# EAGLE schematic sh7_redraw (EAGLE 8.5.1)
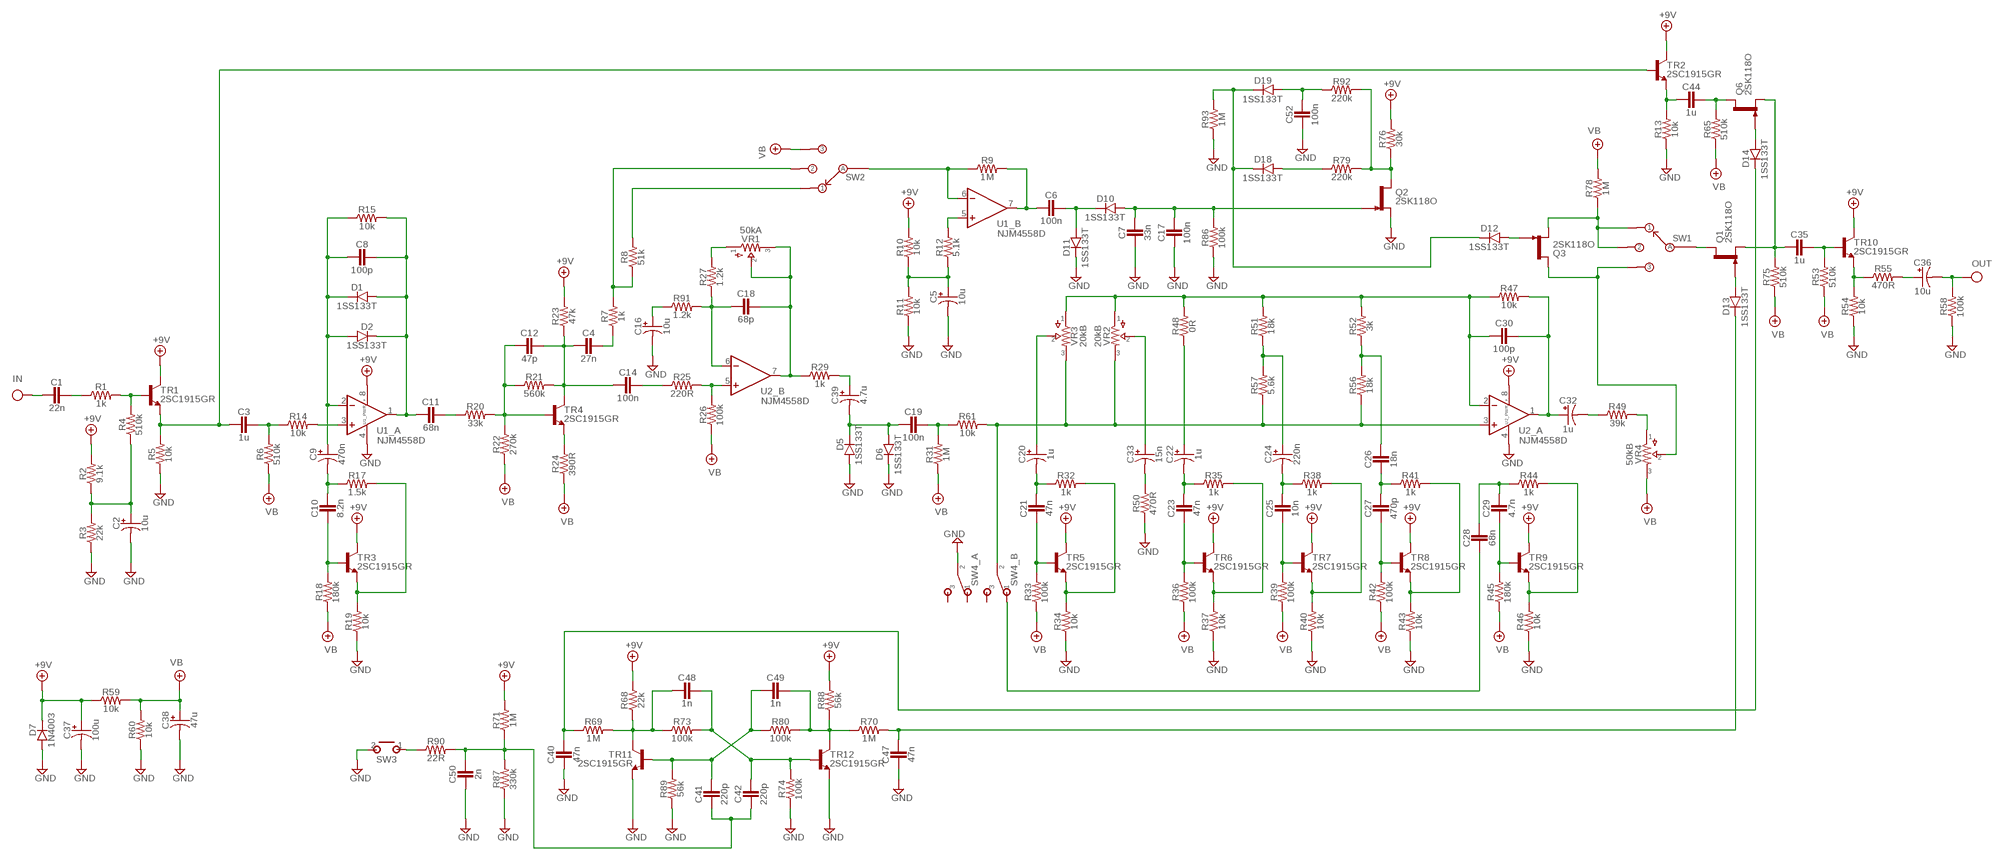
[diagram p0: schematic, sheet 1]

## Parts
C1  22n  CER/FILMBOX.1  [BOX_SMALL]
C2  10u  0400  [040_020]
C3  1u  CER/FILMBOX.1  [BOX_SMALL]
C4  27n  CER/FILMBOX.1  [BOX_SMALL]
C5  10u  0400  [040_020]
C6  100n  CER/FILMBOX.1  [BOX_SMALL]
C7  33n  CER/FILMBOX.1  [BOX_SMALL]
C8  100p  CER/FILMBOX.1  [BOX_SMALL]
C9  470n  0400  [040_020]
C10  8.2n  CER/FILMBOX.1  [BOX_SMALL]
C11  68n  CER/FILMBOX.1  [BOX_SMALL]
C12  47p  CER/FILMBOX.1  [BOX_SMALL]
C14  100n  CER/FILMBOX.1  [BOX_SMALL]
C16  10u  0400  [040_020]
C17  100n  CER/FILMBOX.1  [BOX_SMALL]
C18  68p  CER/FILMBOX.1  [BOX_SMALL]
C19  100n  CER/FILMBOX.1  [BOX_SMALL]
C20  1u  0400  [040_020]
C21  47n  CER/FILMBOX.1  [BOX_SMALL]
C22  1u  0400  [040_020]
C23  47n  CER/FILMBOX.1  [BOX_SMALL]
C24  220n  0400  [040_020]
C25  10n  CER/FILMBOX.1  [BOX_SMALL]
C26  18n  CER/FILMBOX.1  [BOX_SMALL]
C27  470p  CER/FILMBOX.1  [BOX_SMALL]
C28  68n  CER/FILMBOX.1  [BOX_SMALL]
C29  4.7n  CER/FILMBOX.1  [BOX_SMALL]
C30  100p  CER/FILMBOX.1  [BOX_SMALL]
C32  1u  0400  [040_020]
C33  15n  0400  [040_020]
C35  1u  CER/FILMBOX.1  [BOX_SMALL]
C36  10u  0400  [040_020]
C37  100u  0400  [040_020]
C38  47u  0400  [040_020]
C39  4.7u  0400  [040_020]
C40  47n  CER/FILMBOX.1  [BOX_SMALL]
C41  220p  CER/FILMBOX.1  [BOX_SMALL]
C42  220p  CER/FILMBOX.1  [BOX_SMALL]
C44  1u  CER/FILMBOX.1  [BOX_SMALL]
C47  47n  CER/FILMBOX.1  [BOX_SMALL]
C48  1n  CER/FILMBOX.1  [BOX_SMALL]
C49  1n  CER/FILMBOX.1  [BOX_SMALL]
C50  2n  CER/FILMBOX.1  [BOX_SMALL]
C52  100n  CER/FILMBOX.1  [BOX_SMALL]
D1  1SS133T  DO41.2  [DO41-2]
D2  1SS133T  DO41.2  [DO41-2]
D5  1SS133T  DO41.2  [DO41-2]
D6  1SS133T  DO41.2  [DO41-2]
D7  1N4003  DO41.2  [DO41-2]
D10  1SS133T  DO41.2  [DO41-2]
D11  1SS133T  DO41.2  [DO41-2]
D12  1SS133T  DO41.2  [DO41-2]
D13  1SS133T  DO41.2  [DO41-2]
D14  1SS133T  DO41.2  [DO41-2]
D18  1SS133T  DO41.2  [DO41-2]
D19  1SS133T  DO41.2  [DO41-2]
Q1  2SK118O  2N5457  [TO92-]
Q2  2SK118O  2N5457  [TO92-]
Q3  2SK118O  2N5457  [TO92-]
Q6  2SK118O  2N5457  [TO92-]
R1  1k  R_.3B  [R0207/3]
R2  9.1k  R_.3B  [R0207/3]
R3  22k  R_.3B  [R0207/3]
R4  510k  R_.3B  [R0207/3]
R5  10k  R_.3B  [R0207/3]
R6  510k  R_.3B  [R0207/3]
R7  1k  R_.3B  [R0207/3]
R8  51k  R_.3B  [R0207/3]
R9  1M  R_.3B  [R0207/3]
R10  10k  R_.3B  [R0207/3]
R11  10k  R_.3B  [R0207/3]
R12  5.1k  R_.3B  [R0207/3]
R13  10k  R_.3B  [R0207/3]
R14  10k  R_.3B  [R0207/3]
R15  10k  R_.3B  [R0207/3]
R17  1.5k  R_.3B  [R0207/3]
R18  180k  R_.3B  [R0207/3]
R19  10k  R_.3B  [R0207/3]
R20  33k  R_.3B  [R0207/3]
R21  560k  R_.3B  [R0207/3]
R22  270k  R_.3B  [R0207/3]
R23  47k  R_.3B  [R0207/3]
R24  390R  R_.3B  [R0207/3]
R25  220R  R_.3B  [R0207/3]
R26  100k  R_.3B  [R0207/3]
R27  1.2k  R_.3B  [R0207/3]
R29  1k  R_.3B  [R0207/3]
R31  1M  R_.3B  [R0207/3]
R32  1k  R_.3B  [R0207/3]
R33  100k  R_.3B  [R0207/3]
R34  10k  R_.3B  [R0207/3]
R35  1k  R_.3B  [R0207/3]
R36  100k  R_.3B  [R0207/3]
R37  10k  R_.3B  [R0207/3]
R38  1k  R_.3B  [R0207/3]
R39  100k  R_.3B  [R0207/3]
R40  10k  R_.3B  [R0207/3]
R41  1k  R_.3B  [R0207/3]
R42  100k  R_.3B  [R0207/3]
R43  10k  R_.3B  [R0207/3]
R44  1k  R_.3B  [R0207/3]
R45  180k  R_.3B  [R0207/3]
R46  10k  R_.3B  [R0207/3]
R47  10k  R_.3B  [R0207/3]
R48  0R  R_.3B  [R0207/3]
R49  39k  R_.3B  [R0207/3]
R50  470R  R_.3B  [R0207/3]
R51  18k  R_.3B  [R0207/3]
R52  3k  R_.3B  [R0207/3]
R53  510k  R_.3B  [R0207/3]
R54  10k  R_.3B  [R0207/3]
R55  470R  R_.3B  [R0207/3]
R56  18k  R_.3B  [R0207/3]
R57  5.6k  R_.3B  [R0207/3]
R58  100k  R_.3B  [R0207/3]
R59  10k  R_.3B  [R0207/3]
R60  10k  R_.3B  [R0207/3]
R61  10k  R_.3B  [R0207/3]
R65  510k  R_.3B  [R0207/3]
R68  22k  R_.3B  [R0207/3]
R69  1M  R_.3B  [R0207/3]
R70  1M  R_.3B  [R0207/3]
R71  1M  R_.3B  [R0207/3]
R73  100k  R_.3B  [R0207/3]
R74  100k  R_.3B  [R0207/3]
R75  510k  R_.3B  [R0207/3]
R76  30k  R_.3B  [R0207/3]
R78  1M  R_.3B  [R0207/3]
R79  220k  R_.3B  [R0207/3]
R80  100k  R_.3B  [R0207/3]
R86  100k  R_.3B  [R0207/3]
R87  330k  R_.3B  [R0207/3]
R88  56k  R_.3B  [R0207/3]
R89  56k  R_.3B  [R0207/3]
R90  22R  R_.3B  [R0207/3]
R91  1.2k  R_.3B  [R0207/3]
R92  220k  R_.3B  [R0207/3]
R93  1M  R_.3B  [R0207/3]
SW1  1P3T  [1P3T]
SW2  1P3T  [1P3T]
SW3  MOMENTARY  [SPST]
SW4  DPDT  [DPDT]
TR1  2SC1915GR  2SC828A  [TO92-]
TR2  2SC1915GR  2SC828A  [TO92-]
TR3  2SC1915GR  2SC828A  [TO92-]
TR4  2SC1915GR  2SC828A  [TO92-]
TR5  2SC1915GR  2SC828A  [TO92-]
TR6  2SC1915GR  2SC828A  [TO92-]
TR7  2SC1915GR  2SC828A  [TO92-]
TR8  2SC1915GR  2SC828A  [TO92-]
TR9  2SC1915GR  2SC828A  [TO92-]
TR10  2SC1915GR  2SC828A  [TO92-]
TR11  2SC1915GR  2SC828A  [TO92-]
TR12  2SC1915GR  2SC828A  [TO92-]
U1  NJM4558D  DUALTH  [DIL0]
U2  NJM4558D  DUALTH  [DIL0]
VR1  50kA  POTS16MM  [16MM]
VR2  20kB  POTS16MM  [16MM]
VR3  20kB  POTS16MM  [16MM]
VR4  50kB  POTS16MM  [16MM]

## Nets
+9V: C37.+ D7.C R2.2 R10.2 R23.2 R59.1 R68.2 R71.2 R76.2 R88.2 TR1.2(C) TR2.2(C) TR3.2(C) TR5.2(C) TR6.2(C) TR7.2(C) TR8.2(C) TR9.2(C) TR10.2(C) U1.8(_PWR:V+) U2.8(_PWR:V+)
GND: C2.- C5.- C7.2 C16.- C17.2 C37.- C38.- C40.2 C47.2 C50.2 C52.2 D5.A D6.C D7.A D11.C Q2.2(S) R3.1 R5.1 R11.1 R13.1 R19.1 R34.1 R37.1 R40.1 R43.1 R46.1 R50.1 R54.1 R58.1 R60.1 R74.1 R86.1 R87.1 R89.1 R93.1 SW3.2(S) SW4.A2 TR11.3(E) TR12.3(E) U1.4(_PWR:V-) U2.4(_PWR:V-)
IN: C1.2
N$1: C1.1 R1.1
N$2: R1.2 R4.2 TR1.1(B)
N$3: C3.2 R5.2 TR1.3(E) TR2.1(B)
N$4: C2.+ R2.1 R3.2 R4.1
N$5: C3.1 R6.2 R14.1
N$6: C9.- C10.1 R17.1
N$7: C11.1 R20.1
N$8: C10.2 R18.2 TR3.1(B)
N$9: R17.2 R19.2 TR3.3(E)
N$10: C8.2 C9.+ D1.C D2.A R15.1 U1.2(_A:-IN)
N$11: C4.1 R7.1
N$12: C12.2 R20.2 R21.1 R22.2 TR4.1(B)
N$13: R14.2 U1.3(_A:+IN)
N$14: C4.2 C12.1 C14.2 R21.2 R23.1 TR4.2(C)
N$15: R24.2 TR4.3(E)
N$16: C14.1 R25.1
N$17: C5.+ R10.1 R11.2 R12.1
N$18: C20.+ VR3.2
N$19: C33.+ VR2.2
N$20: C30.2 R47.1 R48.2 R51.2 R52.2 U2.2(_A:-IN) VR2.1 VR3.1
N$21: C22.+ R48.1
N$22: C22.- C23.1 R35.1
N$23: C23.2 R36.2 TR6.1(B)
N$24: R35.2 R37.2 TR6.3(E)
N$25: C40.1 D14.C R69.1
N$26: C47.1 D13.C R70.2
N$27: C24.+ R51.1 R57.2
N$28: C24.- C25.1 R38.1
N$29: C48.2 R68.1 R69.2 R73.1 TR11.2(C)
N$30: C25.2 R39.2 TR7.1(B)
N$31: C49.1 R70.1 R80.2 R88.1 TR12.2(C)
N$32: C41.1 C49.2 R80.1 R89.2 TR11.1(B)
N$33: R38.2 R40.2 TR7.3(E)
N$34: C42.1 C48.1 R73.2 R74.2 TR12.1(B)
N$35: C26.1 R52.1 R56.2
N$36: C41.2 C42.2 C50.1 R71.1 R87.2 R90.2
N$37: C26.2 C27.1 R41.1
N$38: R90.1 SW3.1(P)
N$39: C27.2 R42.2 TR8.1(B)
N$40: R41.2 R43.2 TR8.3(E)
N$41: C28.2 C29.1 R44.1
N$42: C29.2 R45.2 TR9.1(B)
N$43: R44.2 R46.2 TR9.3(E)
N$44: C32.- R49.1
N$45: C30.1 C32.+ R47.2 U2.1(_A:OUT)
N$46: R49.2 VR4.1
N$47: C44.2 R13.2 TR2.3(E)
N$48: C44.1 Q6.3(D) R65.2
N$49: R25.2 R26.2 U2.5(_B:+IN)
N$50: D14.A Q6.1(G)
N$51: C35.2 Q1.2(S) Q6.2(S) R75.2
N$52: Q3.3(D) SW1.P$4 VR4.2
N$53: D13.A Q1.1(G)
N$54: C35.1 R53.2 TR10.1(B)
N$55: R54.2 R55.1 TR10.3(E)
N$56: C36.+ R55.2
N$57: R7.2 R8.1 SW2.P$3
N$58: C16.+ R91.1
N$59: C18.2 R27.1 R91.2 U2.6(_B:-IN)
N$60: R27.2 VR1.1
N$61: C18.1 R29.1 U2.7(_B:OUT) VR1.2 VR1.3
N$62: C39.+ R29.2
N$63: C19.2 C39.- D5.C D6.A
N$64: C19.1 R31.2 R61.1
N$65: R56.1 R57.1 R61.2 SW4.B2 U2.3(_A:+IN) VR2.3 VR3.3
N$66: R9.1 SW2.P$1(A) U1.6(_B:-IN)
N$67: C6.2 R9.2 U1.7(_B:OUT)
N$68: C20.- C21.1 R32.1
N$69: C21.2 R33.2 TR5.1(B)
N$70: R32.2 R34.2 TR5.3(E)
N$71: C8.1 C11.2 D1.A D2.C R15.2 U1.1(_A:OUT)
N$72: C33.- R50.2
N$73: C28.1 SW4.B1
N$74: R12.2 U1.5(_B:+IN)
N$75: C6.1 D10.C D11.A
N$76: R8.2 SW2.P$2
N$77: C7.1 C17.1 D10.A Q2.1(G) R86.2
N$79: Q2.3(D) R76.1 R79.2 R92.2
N$80: C52.1 D19.A R92.1
N$81: D18.A R79.1
N$82: D12.C D18.C D19.C R93.2
N$84: Q3.2(S) R78.1 SW1.P$2 SW1.P$3
N$85: D12.A Q3.1(G)
N$86: Q1.3(D) SW1.P$1(A)
OUT: C36.- R58.2
VB: C38.+ R6.1 R18.1 R22.1 R24.1 R26.1 R31.1 R33.1 R36.1 R39.1 R42.1 R45.1 R53.1 R59.2 R60.2 R65.1 R75.1 R78.2 SW2.P$4 VR4.3
Unconnected: SW4.A1 SW4.A3 SW4.B3

## Library data of the parts
C1 C3 C4 C6-C8 C10-C12 C14 C17-C19 C21 C23 C25-C30 C35 C40-C42 C44 C47-C50 C52 = pedals-capacitors-film:CER/FILM: 47 - 120pF Xicon Ceramic Disc 2.5mm lead spacing
C2 C5 C9 C16 C20 C22 C24 C32 C33 C36-C39 = pedals-capacitors-elec:040
D1 D2 D5-D7 D10-D14 D18 D19 = pedals-diodes:DO41: DO-41 Package Diodes: 1N4001 - 1N40019 Zener Diodes: 1N4728 - 1N4764
Q1-Q3 Q6 = pedals-transistors:2N5457: N-CHANNEL JFET
R1-R15 R17-R27 R29 R31-R61 R65 R68-R71 R73-R76 R78-R80 R86-R93 = pedals-resistors:R_
SW1 SW2 = pedals-switches:1P3T
SW3 = pedals-switches:MOMENTARY
SW4 = pedals-switches:DPDT
TR1-TR12 = pedals-transistors:2SC828A
U1 U2 = pedals-integrated circuits:DUAL: OP AMP
VR1-VR4 = pedals-potentiometers:POTS